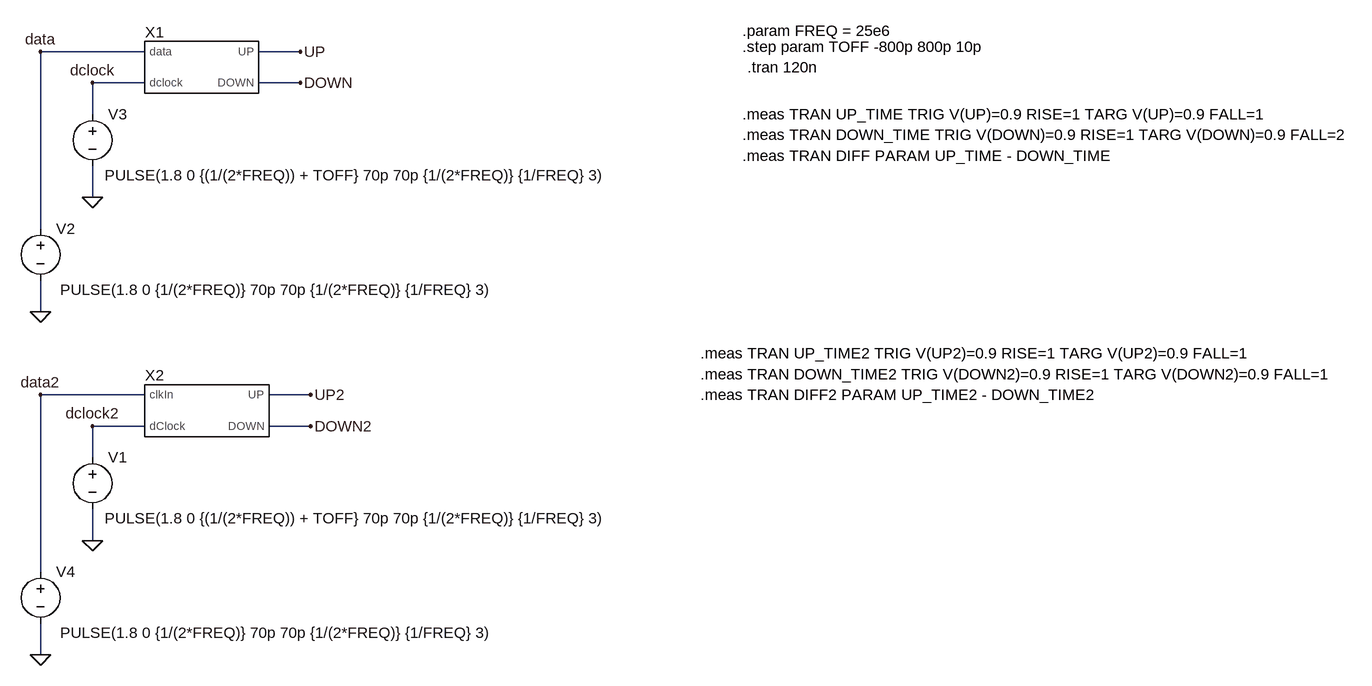
[diagram p0: schematic pfd_test.asc]
pfd_test.asc, the LTspice schematic file:
Version 4
SHEET 1 1992 1140
WIRE 96 144 -64 144
WIRE 336 144 272 144
WIRE 96 192 16 192
WIRE 336 192 272 192
WIRE 16 240 16 192
WIRE 16 368 16 320
WIRE -64 416 -64 144
WIRE -64 544 -64 496
WIRE 96 672 -64 672
WIRE 352 672 288 672
WIRE 96 720 16 720
WIRE 352 720 288 720
WIRE 16 768 16 720
WIRE 16 896 16 848
WIRE -64 944 -64 672
WIRE -64 1072 -64 1024
FLAG 16 368 0
FLAG -64 544 0
FLAG 336 144 UP
FLAG 336 192 DOWN
FLAG -64 144 data
FLAG 16 192 dclock
FLAG 16 896 0
FLAG -64 1072 0
FLAG 352 672 UP2
FLAG 352 720 DOWN2
FLAG -64 672 data2
FLAG 16 720 dclock2
SYMBOL pfd2 128 176 R0
SYMATTR InstName X1
SYMBOL voltage 16 224 R0
WINDOW 3 19 110 Left 2
WINDOW 123 0 0 Left 0
WINDOW 39 0 0 Left 0
SYMATTR Value PULSE(1.8 0 {(1/(2*FREQ)) + TOFF} 70p 70p {1/(2*FREQ)} {1/FREQ} 3)
SYMATTR InstName V3
SYMBOL voltage -64 400 R0
WINDOW 3 30 110 Left 2
WINDOW 123 0 0 Left 0
WINDOW 39 0 0 Left 0
SYMATTR Value PULSE(1.8 0 {1/(2*FREQ)} 70p 70p {1/(2*FREQ)} {1/FREQ} 3)
SYMATTR InstName V2
SYMBOL voltage 16 752 R0
WINDOW 3 19 110 Left 2
WINDOW 123 0 0 Left 0
WINDOW 39 0 0 Left 0
SYMATTR Value PULSE(1.8 0 {(1/(2*FREQ)) + TOFF} 70p 70p {1/(2*FREQ)} {1/FREQ} 3)
SYMATTR InstName V1
SYMBOL voltage -64 928 R0
WINDOW 3 30 110 Left 2
WINDOW 123 0 0 Left 0
WINDOW 39 0 0 Left 0
SYMATTR Value PULSE(1.8 0 {1/(2*FREQ)} 70p 70p {1/(2*FREQ)} {1/FREQ} 3)
SYMATTR InstName V4
SYMBOL pfd 128 704 R0
SYMATTR InstName X2
TEXT 1016 112 Left 2 !.param FREQ = 25e6
TEXT 1024 168 Left 2 !.tran 120n
TEXT 1016 136 Left 2 !.step param TOFF -800p 800p 10p
TEXT 1016 240 Left 2 !.meas TRAN UP_TIME TRIG V(UP)=0.9 RISE=1 TARG V(UP)=0.9 FALL=1
TEXT 1016 272 Left 2 !.meas TRAN DOWN_TIME TRIG V(DOWN)=0.9 RISE=1 TARG V(DOWN)=0.9 FALL=2
TEXT 1016 304 Left 2 !.meas TRAN DIFF PARAM UP_TIME - DOWN_TIME
TEXT 952 608 Left 2 !.meas TRAN UP_TIME2 TRIG V(UP2)=0.9 RISE=1 TARG V(UP2)=0.9 FALL=1
TEXT 952 640 Left 2 !.meas TRAN DOWN_TIME2 TRIG V(DOWN2)=0.9 RISE=1 TARG V(DOWN2)=0.9 FALL=1
TEXT 952 672 Left 2 !.meas TRAN DIFF2 PARAM UP_TIME2 - DOWN_TIME2

The netlist it stands for:
* pfd_test.asc
XX1 data dclock UP DOWN pfd2 VDD=1.8 L=0.18u LD=0.48u WN=0.42u WPFACT=1.5  ; pins data dclock UP DOWN
V3 dclock 0 PULSE(1.8 0 {(1/(2*FREQ)) + TOFF} 70p 70p {1/(2*FREQ)} {1/FREQ} 3)
V2 data 0 PULSE(1.8 0 {1/(2*FREQ)} 70p 70p {1/(2*FREQ)} {1/FREQ} 3)
V1 dclock2 0 PULSE(1.8 0 {(1/(2*FREQ)) + TOFF} 70p 70p {1/(2*FREQ)} {1/FREQ} 3)
V4 data2 0 PULSE(1.8 0 {1/(2*FREQ)} 70p 70p {1/(2*FREQ)} {1/FREQ} 3)
XX2 data2 dclock2 UP2 DOWN2 pfd VDD=1.8 L=0.18u LD=0.48u WN=0.42u  ; pins clkIn dClock UP DOWN
.param FREQ = 25e6
.tran 120n
.step param TOFF -800p 800p 10p
.meas TRAN UP_TIME TRIG V(UP)=0.9 RISE=1 TARG V(UP)=0.9 FALL=1
.meas TRAN DOWN_TIME TRIG V(DOWN)=0.9 RISE=1 TARG V(DOWN)=0.9 FALL=2
.meas TRAN DIFF PARAM UP_TIME - DOWN_TIME
.meas TRAN UP_TIME2 TRIG V(UP2)=0.9 RISE=1 TARG V(UP2)=0.9 FALL=1
.meas TRAN DOWN_TIME2 TRIG V(DOWN2)=0.9 RISE=1 TARG V(DOWN2)=0.9 FALL=1
.meas TRAN DIFF2 PARAM UP_TIME2 - DOWN_TIME2
.backanno
.end